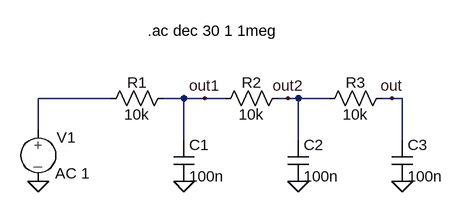
[diagram p0: schematic tP_2ordnung.asc]
tP_2ordnung.asc, the LTspice schematic file:
Version 4
SHEET 1 880 680
WIRE 144 96 32 96
WIRE 256 96 224 96
WIRE 288 96 256 96
WIRE 320 96 288 96
WIRE 416 96 400 96
WIRE 432 96 416 96
WIRE 480 96 432 96
WIRE 576 96 560 96
WIRE 592 96 576 96
WIRE 32 144 32 96
WIRE 256 160 256 96
WIRE 432 160 432 96
WIRE 592 160 592 96
FLAG 32 224 0
FLAG 256 224 0
FLAG 432 224 0
FLAG 416 96 out2
FLAG 592 224 0
FLAG 576 96 out
FLAG 288 96 out1
SYMBOL Source-V 32 128 R0
WINDOW 123 26 84 Left 0
WINDOW 39 0 0 Left 0
SYMATTR Value2 AC 1
SYMATTR InstName V1
SYMATTR Value ""
SYMBOL res 240 80 R90
WINDOW 0 7 56 VBottom 0
WINDOW 3 25 56 VTop 0
SYMATTR InstName R1
SYMATTR Value 10k
SYMBOL cap 240 160 R0
SYMATTR InstName C1
SYMATTR Value 100n
SYMBOL res 416 80 R90
WINDOW 0 7 56 VBottom 0
WINDOW 3 25 56 VTop 0
SYMATTR InstName R2
SYMATTR Value 10k
SYMBOL cap 416 160 R0
SYMATTR InstName C2
SYMATTR Value 100n
SYMBOL res 576 80 R90
WINDOW 0 7 56 VBottom 0
WINDOW 3 25 56 VTop 0
SYMATTR InstName R3
SYMATTR Value 10k
SYMBOL cap 576 160 R0
SYMATTR InstName C3
SYMATTR Value 100n
TEXT 200 -8 Left 0 !.ac dec 30 1 1meg

The netlist it stands for:
* tP_2ordnung.asc
V1 N001 0 AC 1
R1 out1 N001 10k
C1 out1 0 100n
R2 out2 out1 10k
C2 out2 0 100n
R3 out out2 10k
C3 out 0 100n
.ac dec 30 1 1meg
.backanno
.end